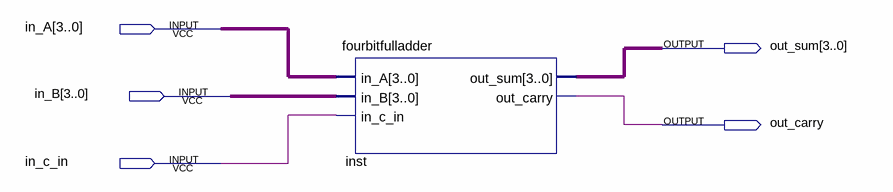
[diagram p0: schematic sheet]
// Quartus schematic Lab5.bdf as structural Verilog: 1 symbols, 5 pins
module Lab5 (
  input  [3:0] in_A,
  input  [3:0] in_B,
  input  in_c_in,
  output [3:0] out_sum,
  output out_carry
);

  fourbitfulladder inst (.in_A(in_A), .in_B(in_B), .in_c_in(in_c_in), .out_sum(out_sum), .out_carry(out_carry));
endmodule
